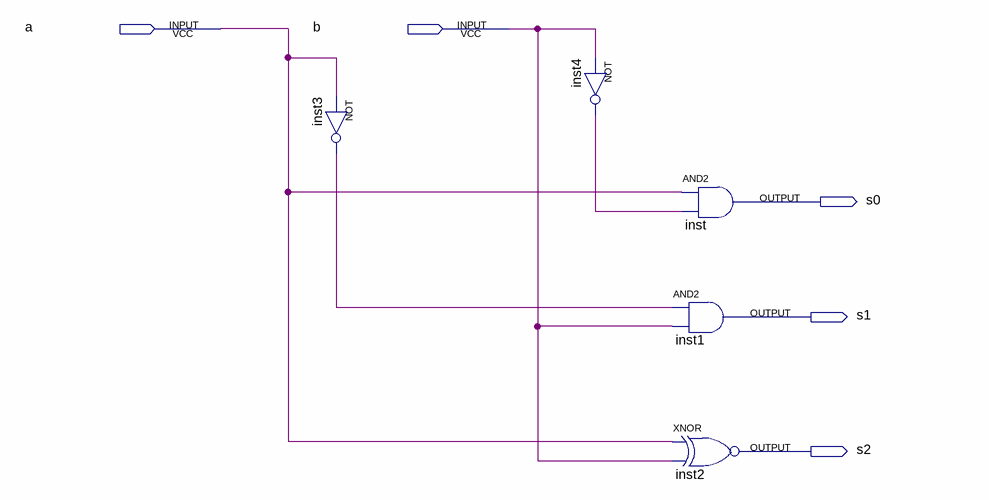
[diagram p0: schematic sheet]
// Quartus schematic Cmp1bit.bdf as structural Verilog: 5 symbols, 5 pins
module Cmp1bit (
  input  a,
  input  b,
  output s0,
  output s1,
  output s2
);

  wire inst3_out, inst4_out;

  not inst3 (inst3_out, a);
  not inst4 (inst4_out, b);
  and inst (s0, a, inst4_out);
  and inst1 (s1, inst3_out, b);
  xnor inst2 (s2, a, b);
endmodule
